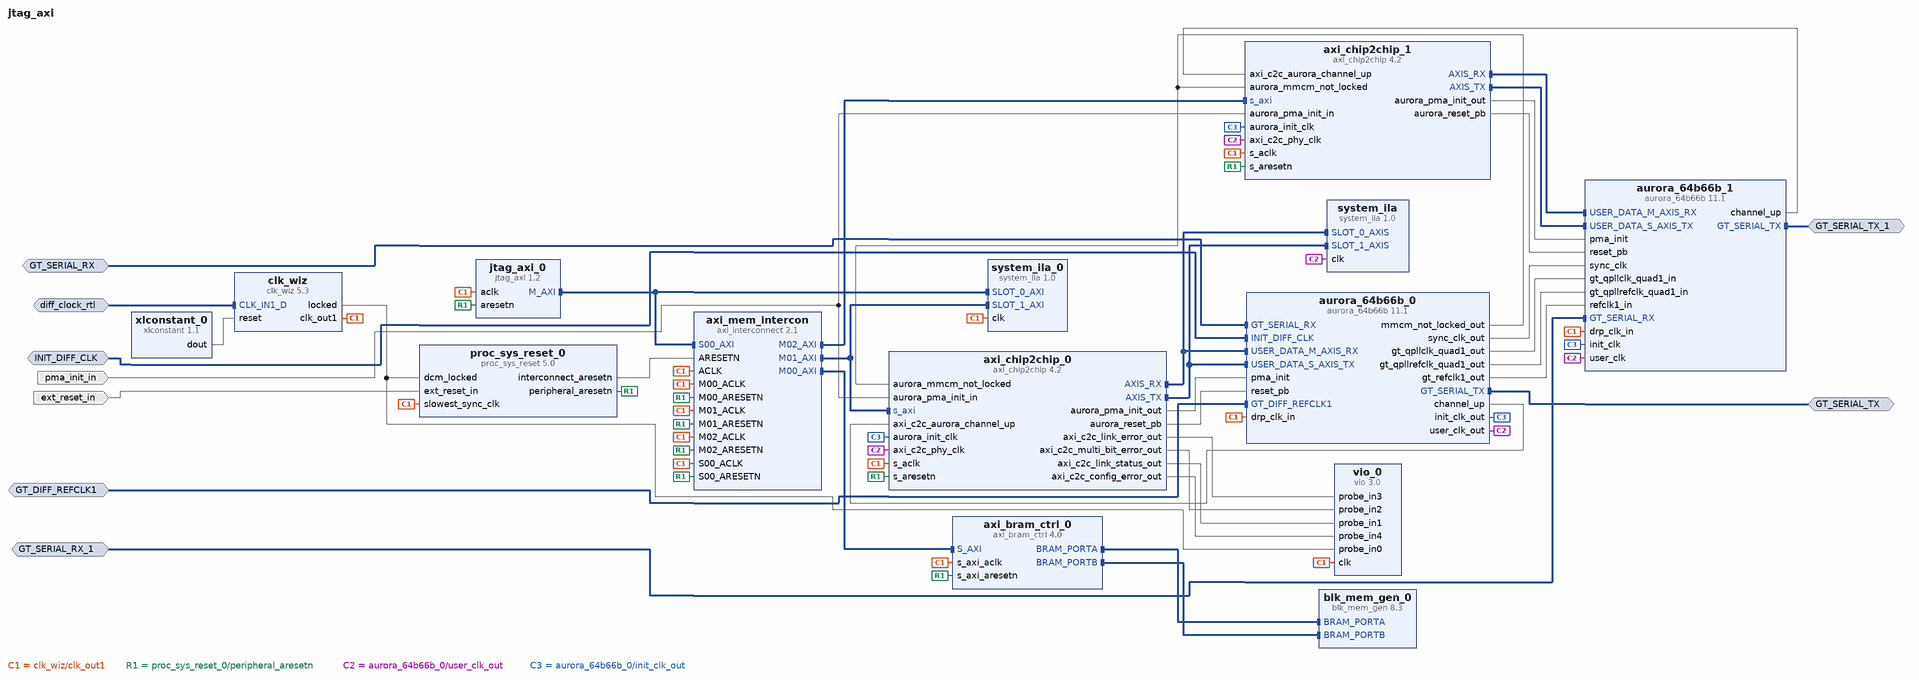
[diagram p0: block diagram of the top level]
# Vivado block design jtag_axi, xc7z045ffv900-2, Vivado 2016.4
create_bd_design jtag_axi

create_bd_intf_port -mode Slave -vlnv xilinx.com:interface:diff_clock_rtl:1.0 diff_clock_rtl
set_property -dict {CONFIG.FREQ_HZ 100000000} [get_bd_intf_ports diff_clock_rtl]
create_bd_intf_port -mode Master -vlnv xilinx.com:display_aurora:GT_Serial_Transceiver_Pins_TX_rtl:1.0 GT_SERIAL_TX
create_bd_intf_port -mode Slave -vlnv xilinx.com:display_aurora:GT_Serial_Transceiver_Pins_RX_rtl:1.0 GT_SERIAL_RX
create_bd_intf_port -mode Slave -vlnv xilinx.com:interface:diff_clock_rtl:1.0 INIT_DIFF_CLK
create_bd_intf_port -mode Slave -vlnv xilinx.com:interface:diff_clock_rtl:1.0 GT_DIFF_REFCLK1
set_property -dict {CONFIG.FREQ_HZ 125000000} [get_bd_intf_ports GT_DIFF_REFCLK1]
create_bd_intf_port -mode Master -vlnv xilinx.com:display_aurora:GT_Serial_Transceiver_Pins_TX_rtl:1.0 GT_SERIAL_TX_1
create_bd_intf_port -mode Slave -vlnv xilinx.com:display_aurora:GT_Serial_Transceiver_Pins_RX_rtl:1.0 GT_SERIAL_RX_1
create_bd_port -dir I -type rst ext_reset_in
set_property -dict {CONFIG.POLARITY ACTIVE_LOW} [get_bd_ports ext_reset_in]
create_bd_port -dir I -type rst pma_init_in
set_property -dict {CONFIG.POLARITY ACTIVE_HIGH} [get_bd_ports pma_init_in]

create_bd_cell -type ip -vlnv xilinx.com:ip:jtag_axi:1.2 jtag_axi_0
create_bd_cell -type ip -vlnv xilinx.com:ip:axi_bram_ctrl:4.0 axi_bram_ctrl_0
create_bd_cell -type ip -vlnv xilinx.com:ip:blk_mem_gen:8.3 blk_mem_gen_0
set_property -dict [list \
  CONFIG.Memory_Type True_Dual_Port_RAM \
  CONFIG.Enable_32bit_Address true \
  CONFIG.Enable_B Use_ENB_Pin \
  CONFIG.Register_PortA_Output_of_Memory_Primitives false \
  CONFIG.Register_PortB_Output_of_Memory_Primitives false \
  CONFIG.Use_RSTA_Pin true \
  CONFIG.Use_RSTB_Pin true \
  CONFIG.Port_B_Clock 100 \
  CONFIG.Port_B_Write_Rate 50 \
  CONFIG.Port_B_Enable_Rate 100 \
  CONFIG.use_bram_block BRAM_Controller \
] [get_bd_cells blk_mem_gen_0]
create_bd_cell -type ip -vlnv xilinx.com:ip:axi_interconnect:2.1 axi_mem_intercon
set_property -dict {CONFIG.NUM_MI 3} [get_bd_cells axi_mem_intercon]
create_bd_cell -type ip -vlnv xilinx.com:ip:clk_wiz:5.3 clk_wiz
set_property -dict [list \
  CONFIG.CLKOUT1_REQUESTED_OUT_FREQ 150.00 \
  CONFIG.PRIM_SOURCE Differential_clock_capable_pin \
  CONFIG.MMCM_DIVCLK_DIVIDE 2 \
  CONFIG.MMCM_CLKFBOUT_MULT_F 19.875 \
  CONFIG.MMCM_CLKOUT0_DIVIDE_F 6.625 \
  CONFIG.CLKOUT1_JITTER 143.858 \
  CONFIG.CLKOUT1_PHASE_ERROR 157.402 \
] [get_bd_cells clk_wiz]
create_bd_cell -type ip -vlnv xilinx.com:ip:vio:3.0 vio_0
set_property -dict {CONFIG.C_NUM_PROBE_OUT 1 CONFIG.C_NUM_PROBE_IN 5} [get_bd_cells vio_0]
create_bd_cell -type ip -vlnv xilinx.com:ip:system_ila:1.0 system_ila_0
set_property -dict [list \
  CONFIG.C_SLOT_1_APC_EN 0 \
  CONFIG.C_SLOT_1_AXI_AW_SEL_DATA 1 \
  CONFIG.C_SLOT_1_AXI_W_SEL_DATA 1 \
  CONFIG.C_SLOT_1_AXI_B_SEL_DATA 1 \
  CONFIG.C_SLOT_1_AXI_AR_SEL_DATA 1 \
  CONFIG.C_SLOT_1_AXI_R_SEL_DATA 1 \
  CONFIG.C_SLOT_1_AXI_AW_SEL_TRIG 1 \
  CONFIG.C_SLOT_1_AXI_W_SEL_TRIG 1 \
  CONFIG.C_SLOT_1_AXI_B_SEL_TRIG 1 \
  CONFIG.C_SLOT_1_AXI_AR_SEL_TRIG 1 \
  CONFIG.C_SLOT_1_AXI_R_SEL_TRIG 1 \
  CONFIG.C_PROBE1_TYPE 0 \
  CONFIG.C_PROBE0_TYPE 0 \
  CONFIG.C_NUM_OF_PROBES 1 \
  CONFIG.C_NUM_MONITOR_SLOTS 2 \
  CONFIG.C_SLOT_1_INTF_TYPE xilinx.com:interface:aximm_rtl:1.0 \
  CONFIG.C_MON_TYPE INTERFACE \
] [get_bd_cells system_ila_0]
create_bd_cell -type ip -vlnv xilinx.com:ip:axi_chip2chip:4.2 axi_chip2chip_0
set_property -dict [list \
  CONFIG.C_INTERFACE_MODE 0 \
  CONFIG.C_INTERFACE_TYPE 2 \
  CONFIG.C_COMMON_CLK 0 \
  CONFIG.C_AURORA_WIDTH 1 \
  CONFIG.C_USE_DIFF_IO false \
  CONFIG.C_USE_DIFF_CLK false \
  CONFIG.C_DISABLE_CLK_SHIFT false \
  CONFIG.C_DISABLE_DESKEW false \
] [get_bd_cells axi_chip2chip_0]
create_bd_cell -type ip -vlnv xilinx.com:ip:aurora_64b66b:11.1 aurora_64b66b_0
set_property -dict [list \
  CONFIG.C_LINE_RATE 6.25 \
  CONFIG.C_REFCLK_FREQUENCY 125.000 \
  CONFIG.C_INIT_CLK 100.0 \
  CONFIG.DRP_FREQ 150.00 \
  CONFIG.interface_mode Streaming \
  CONFIG.drp_mode Disabled \
  CONFIG.SupportLevel 1 \
] [get_bd_cells aurora_64b66b_0]
create_bd_cell -type ip -vlnv xilinx.com:ip:system_ila:1.0 system_ila
set_property -dict [list \
  CONFIG.C_SLOT_0_APC_EN 0 \
  CONFIG.C_SLOT_1_APC_EN 0 \
  CONFIG.C_SLOT_0_AXI_DATA_SEL 1 \
  CONFIG.C_SLOT_1_AXI_DATA_SEL 1 \
  CONFIG.C_SLOT_0_AXI_TRIG_SEL 1 \
  CONFIG.C_SLOT_1_AXI_TRIG_SEL 1 \
  CONFIG.C_NUM_MONITOR_SLOTS 2 \
  CONFIG.C_SLOT_0_INTF_TYPE xilinx.com:interface:axis_rtl:1.0 \
  CONFIG.C_SLOT_1_INTF_TYPE xilinx.com:interface:axis_rtl:1.0 \
  CONFIG.C_MON_TYPE INTERFACE \
] [get_bd_cells system_ila]
create_bd_cell -type ip -vlnv xilinx.com:ip:xlconstant:1.1 xlconstant_0
set_property -dict {CONFIG.CONST_VAL 0} [get_bd_cells xlconstant_0]
create_bd_cell -type ip -vlnv xilinx.com:ip:proc_sys_reset:5.0 proc_sys_reset_0
create_bd_cell -type ip -vlnv xilinx.com:ip:axi_chip2chip:4.2 axi_chip2chip_1
set_property -dict [list \
  CONFIG.C_INTERFACE_MODE 0 \
  CONFIG.C_INTERFACE_TYPE 2 \
  CONFIG.C_COMMON_CLK 0 \
  CONFIG.C_AURORA_WIDTH 1 \
  CONFIG.C_USE_DIFF_IO false \
  CONFIG.C_USE_DIFF_CLK false \
  CONFIG.C_DISABLE_CLK_SHIFT false \
  CONFIG.C_DISABLE_DESKEW false \
] [get_bd_cells axi_chip2chip_1]
create_bd_cell -type ip -vlnv xilinx.com:ip:aurora_64b66b:11.1 aurora_64b66b_1
set_property -dict [list \
  CONFIG.C_LINE_RATE 6.25 \
  CONFIG.C_REFCLK_FREQUENCY 125.000 \
  CONFIG.C_INIT_CLK 100.0 \
  CONFIG.DRP_FREQ 150.00 \
  CONFIG.interface_mode Streaming \
  CONFIG.drp_mode Disabled \
  CONFIG.SupportLevel 0 \
] [get_bd_cells aurora_64b66b_1]

# ---- connections ----

connect_bd_intf_net [get_bd_intf_pins jtag_axi_0/M_AXI] [get_bd_intf_pins axi_mem_intercon/S00_AXI]
connect_bd_intf_net [get_bd_intf_pins jtag_axi_0/M_AXI] [get_bd_intf_pins system_ila_0/SLOT_0_AXI]
connect_bd_intf_net [get_bd_intf_pins axi_mem_intercon/M00_AXI] [get_bd_intf_pins axi_bram_ctrl_0/S_AXI]
connect_bd_intf_net [get_bd_intf_pins blk_mem_gen_0/BRAM_PORTA] [get_bd_intf_pins axi_bram_ctrl_0/BRAM_PORTA]
connect_bd_intf_net [get_bd_intf_pins blk_mem_gen_0/BRAM_PORTB] [get_bd_intf_pins axi_bram_ctrl_0/BRAM_PORTB]
connect_bd_intf_net [get_bd_intf_pins axi_chip2chip_0/AXIS_RX] [get_bd_intf_pins aurora_64b66b_0/USER_DATA_M_AXIS_RX]
connect_bd_intf_net [get_bd_intf_pins axi_chip2chip_0/AXIS_RX] [get_bd_intf_pins system_ila/SLOT_0_AXIS]
connect_bd_intf_net [get_bd_intf_pins axi_chip2chip_0/AXIS_TX] [get_bd_intf_pins aurora_64b66b_0/USER_DATA_S_AXIS_TX]
connect_bd_intf_net [get_bd_intf_pins axi_chip2chip_0/AXIS_TX] [get_bd_intf_pins system_ila/SLOT_1_AXIS]
connect_bd_intf_net -intf_net axi_mem_intercon_M03_AXI [get_bd_intf_pins axi_mem_intercon/M01_AXI] [get_bd_intf_pins axi_chip2chip_0/s_axi]
connect_bd_intf_net [get_bd_intf_pins axi_mem_intercon/M01_AXI] [get_bd_intf_pins system_ila_0/SLOT_1_AXI]
connect_bd_intf_net [get_bd_intf_pins axi_chip2chip_1/AXIS_RX] [get_bd_intf_pins aurora_64b66b_1/USER_DATA_M_AXIS_RX]
connect_bd_intf_net [get_bd_intf_pins axi_chip2chip_1/AXIS_TX] [get_bd_intf_pins aurora_64b66b_1/USER_DATA_S_AXIS_TX]
connect_bd_intf_net [get_bd_intf_pins axi_mem_intercon/M02_AXI] [get_bd_intf_pins axi_chip2chip_1/s_axi]
connect_bd_intf_net [get_bd_intf_ports diff_clock_rtl] [get_bd_intf_pins clk_wiz/CLK_IN1_D]
connect_bd_intf_net [get_bd_intf_ports GT_SERIAL_TX] [get_bd_intf_pins aurora_64b66b_0/GT_SERIAL_TX]
connect_bd_intf_net [get_bd_intf_ports GT_SERIAL_RX] [get_bd_intf_pins aurora_64b66b_0/GT_SERIAL_RX]
connect_bd_intf_net [get_bd_intf_ports INIT_DIFF_CLK] [get_bd_intf_pins aurora_64b66b_0/INIT_DIFF_CLK]
connect_bd_intf_net -intf_net GT_DIFF_REFCLK1_1 [get_bd_intf_ports GT_DIFF_REFCLK1] [get_bd_intf_pins aurora_64b66b_0/GT_DIFF_REFCLK1]
connect_bd_intf_net [get_bd_intf_ports GT_SERIAL_TX_1] [get_bd_intf_pins aurora_64b66b_1/GT_SERIAL_TX]
connect_bd_intf_net -intf_net GT_SERIAL_RX_1_1 [get_bd_intf_ports GT_SERIAL_RX_1] [get_bd_intf_pins aurora_64b66b_1/GT_SERIAL_RX]
connect_bd_net [get_bd_pins clk_wiz/clk_out1] \
  [get_bd_pins jtag_axi_0/aclk] [get_bd_pins axi_bram_ctrl_0/s_axi_aclk] [get_bd_pins vio_0/clk] \
  [get_bd_pins system_ila_0/clk] [get_bd_pins axi_chip2chip_0/s_aclk] [get_bd_pins aurora_64b66b_0/drp_clk_in] \
  [get_bd_pins proc_sys_reset_0/slowest_sync_clk] [get_bd_pins axi_mem_intercon/S00_ACLK] [get_bd_pins axi_mem_intercon/ACLK] \
  [get_bd_pins axi_mem_intercon/M00_ACLK] [get_bd_pins axi_mem_intercon/M01_ACLK] [get_bd_pins axi_chip2chip_1/s_aclk] \
  [get_bd_pins axi_mem_intercon/M02_ACLK] [get_bd_pins aurora_64b66b_1/drp_clk_in]
connect_bd_net [get_bd_pins clk_wiz/locked] [get_bd_pins vio_0/probe_in0] [get_bd_pins proc_sys_reset_0/dcm_locked]
connect_bd_net -net rst_clk_wiz_100M_peripheral_aresetn [get_bd_pins proc_sys_reset_0/peripheral_aresetn] \
  [get_bd_pins jtag_axi_0/aresetn] [get_bd_pins axi_bram_ctrl_0/s_axi_aresetn] [get_bd_pins axi_chip2chip_0/s_aresetn] \
  [get_bd_pins axi_mem_intercon/S00_ARESETN] [get_bd_pins axi_mem_intercon/M00_ARESETN] \
  [get_bd_pins axi_mem_intercon/M01_ARESETN] [get_bd_pins axi_chip2chip_1/s_aresetn] \
  [get_bd_pins axi_mem_intercon/M02_ARESETN]
connect_bd_net [get_bd_pins aurora_64b66b_0/user_clk_out] \
  [get_bd_pins axi_chip2chip_0/axi_c2c_phy_clk] [get_bd_pins system_ila/clk] [get_bd_pins aurora_64b66b_1/user_clk] \
  [get_bd_pins axi_chip2chip_1/axi_c2c_phy_clk]
connect_bd_net [get_bd_pins aurora_64b66b_0/channel_up] [get_bd_pins axi_chip2chip_0/axi_c2c_aurora_channel_up]
connect_bd_net [get_bd_pins aurora_64b66b_0/mmcm_not_locked_out] \
  [get_bd_pins axi_chip2chip_0/aurora_mmcm_not_locked] [get_bd_pins axi_chip2chip_1/aurora_mmcm_not_locked]
connect_bd_net [get_bd_pins axi_chip2chip_0/aurora_pma_init_out] [get_bd_pins aurora_64b66b_0/pma_init]
connect_bd_net [get_bd_pins axi_chip2chip_0/aurora_reset_pb] [get_bd_pins aurora_64b66b_0/reset_pb]
connect_bd_net [get_bd_pins aurora_64b66b_0/init_clk_out] \
  [get_bd_pins axi_chip2chip_0/aurora_init_clk] [get_bd_pins aurora_64b66b_1/init_clk] \
  [get_bd_pins axi_chip2chip_1/aurora_init_clk]
connect_bd_net [get_bd_pins axi_chip2chip_0/axi_c2c_link_error_out] [get_bd_pins vio_0/probe_in3]
connect_bd_net [get_bd_pins axi_chip2chip_0/axi_c2c_multi_bit_error_out] [get_bd_pins vio_0/probe_in2]
connect_bd_net [get_bd_pins axi_chip2chip_0/axi_c2c_link_status_out] [get_bd_pins vio_0/probe_in1]
connect_bd_net [get_bd_pins axi_chip2chip_0/axi_c2c_config_error_out] [get_bd_pins vio_0/probe_in4]
connect_bd_net [get_bd_pins xlconstant_0/dout] [get_bd_pins clk_wiz/reset]
connect_bd_net [get_bd_ports ext_reset_in] [get_bd_pins proc_sys_reset_0/ext_reset_in]
connect_bd_net [get_bd_pins proc_sys_reset_0/interconnect_aresetn] [get_bd_pins axi_mem_intercon/ARESETN]
connect_bd_net [get_bd_ports pma_init_in] [get_bd_pins axi_chip2chip_0/aurora_pma_init_in] [get_bd_pins axi_chip2chip_1/aurora_pma_init_in]
connect_bd_net [get_bd_pins aurora_64b66b_1/channel_up] [get_bd_pins axi_chip2chip_1/axi_c2c_aurora_channel_up]
connect_bd_net [get_bd_pins axi_chip2chip_1/aurora_pma_init_out] [get_bd_pins aurora_64b66b_1/pma_init]
connect_bd_net [get_bd_pins axi_chip2chip_1/aurora_reset_pb] [get_bd_pins aurora_64b66b_1/reset_pb]
connect_bd_net [get_bd_pins aurora_64b66b_0/sync_clk_out] [get_bd_pins aurora_64b66b_1/sync_clk]
connect_bd_net [get_bd_pins aurora_64b66b_0/gt_qpllclk_quad1_out] [get_bd_pins aurora_64b66b_1/gt_qpllclk_quad1_in]
connect_bd_net [get_bd_pins aurora_64b66b_0/gt_qpllrefclk_quad1_out] [get_bd_pins aurora_64b66b_1/gt_qpllrefclk_quad1_in]
connect_bd_net [get_bd_pins aurora_64b66b_0/gt_refclk1_out] [get_bd_pins aurora_64b66b_1/refclk1_in]

# ---- address map ----
assign_bd_address -offset 0x76000000 -range 16K -target_address_space [get_bd_addr_spaces jtag_axi_0/Data] [get_bd_addr_segs axi_chip2chip_0/s_axi/Mem0]
assign_bd_address -offset 0x76010000 -range 16K -target_address_space [get_bd_addr_spaces jtag_axi_0/Data] [get_bd_addr_segs axi_chip2chip_1/s_axi/Mem0]
assign_bd_address -offset 0xC0000000 -range 8K -target_address_space [get_bd_addr_spaces jtag_axi_0/Data] [get_bd_addr_segs axi_bram_ctrl_0/S_AXI/Mem0]

validate_bd_design
save_bd_design
